# Altium schematic sheet Microcontroller.SchDoc
size A4; SheetNumber: 7; SheetTotal: 8
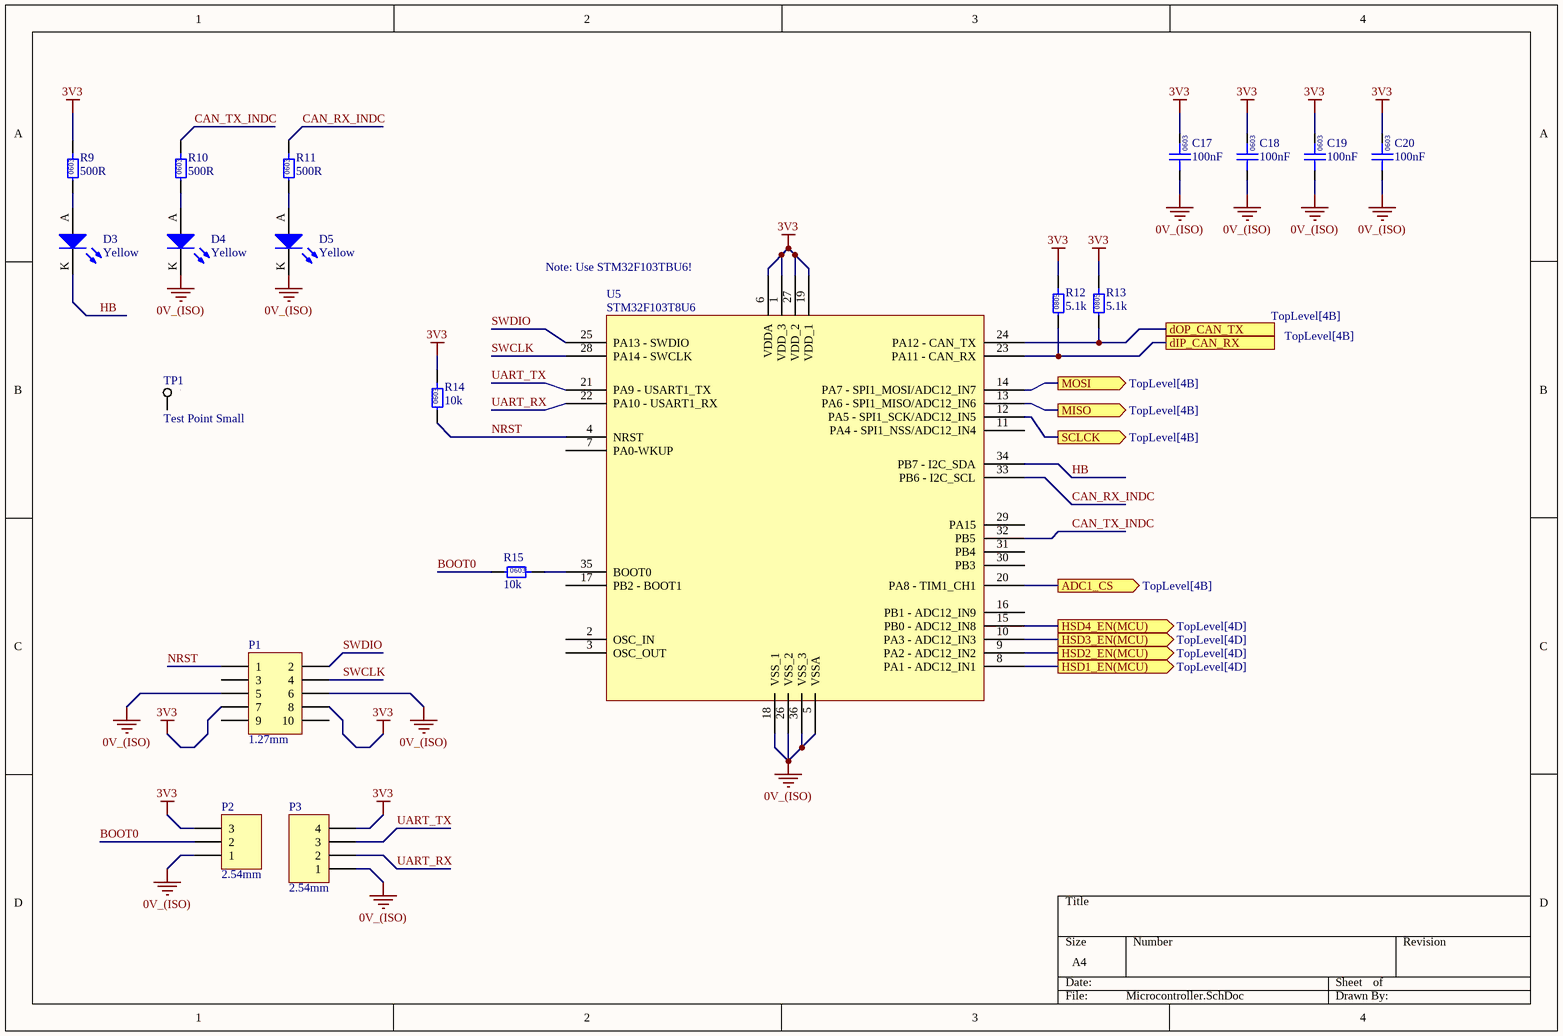
[diagram p0: Microcontroller.SchDoc]

## Parts
C17  100nF  [0603]
C18  100nF  [0603]
C19  100nF  [0603]
C20  100nF  [0603]
D3  Yellow  [0805 LED]
D4  Yellow  [0805 LED]
D5  Yellow  [0805 LED]
P1  1.27mm  [3221-10-0300-00]
P2  2.54mm  [TH 2.54mm Header 1x3]
P3  2.54mm  [TH 2.54mm Header 1x4]
R9  500R  [0603]
R10  500R  [0603]
R11  500R  [0603]
R12  5.1k  [0805]
R13  5.1k  [0805]
R14  10k  [0603]
R15  10k  [0603]
TP1  Test Point Small  [SMD Test Point 1mm]
U5  STM32F103T8U6  [STM_QFN-36]

## Ports
ADC1_CS (out, see TopLevel[4B]), dIP_CAN_RX (see TopLevel[4B]), dOP_CAN_TX (see TopLevel[4B]), HSD1_EN(MCU) (out, see TopLevel[4D]), HSD2_EN(MCU) (out, see TopLevel[4D]), HSD3_EN(MCU) (out, see TopLevel[4D]), HSD4_EN(MCU) (out, see TopLevel[4D]), MISO (out, see TopLevel[4B]), MOSI (out, see TopLevel[4B]), SCLCK (out, see TopLevel[4B])

## Nets
0V_(ISO): C17.1 C18.1 C19.1 C20.1 D4.K D5.K P1.5 P1.6 P2.1 P3.1 U5.5(VSSA) U5.18(VSS_1) U5.26(VSS_2) U5.36(VSS_3)
3V3: C17.2 C18.2 C19.2 C20.2 P1.7 P1.8 P2.3 P3.4 R9.2 R12.2 R13.2 R14.2 U5.1(VDD_3) U5.6(VDDA) U5.19(VDD_1) U5.27(VDD_2)
ADC1_CS: U5.20(PA8_-_TIM1_CH1) ; port ADC1_CS
BOOT0: P2.2 R15.1
CAN_RX_INDC: R11.2 U5.33(PB6_-_I2C_SCL)
CAN_TX_INDC: R10.2 U5.32(PB5)
dIP_CAN_RX: R12.1 U5.23(PA11_-_CAN_RX) ; port dIP_CAN_RX
dOP_CAN_TX: R13.1 U5.24(PA12_-_CAN_TX) ; port dOP_CAN_TX
HB: D3.K U5.34(PB7_-_I2C_SDA)
HSD1_EN(MCU): U5.8(PA1_-_ADC12_IN1) ; port HSD1_EN(MCU)
HSD2_EN(MCU): U5.9(PA2_-_ADC12_IN2) ; port HSD2_EN(MCU)
HSD3_EN(MCU): U5.10(PA3_-_ADC12_IN3) ; port HSD3_EN(MCU)
HSD4_EN(MCU): U5.15(PB0_-_ADC12_IN8) ; port HSD4_EN(MCU)
MISO: U5.13(PA6_-_SPI1_MISO/ADC12_IN6) ; port MISO
MOSI: U5.14(PA7_-_SPI1_MOSI/ADC12_IN7) ; port MOSI
NRST: P1.1 R14.1 U5.4(NRST)
SCLCK: U5.12(PA5_-_SPI1_SCK/ADC12_IN5) ; port SCLCK
SWCLK: P1.4 U5.28(PA14_-_SWCLK)
SWDIO: P1.2 U5.25(PA13_-_SWDIO)
UART_RX: P3.2 U5.22(PA10_-_USART1_RX)
UART_TX: P3.3 U5.21(PA9_-_USART1_TX)
NetD3_A: D3.A R9.1
NetD4_A: D4.A R10.1
NetD5_A: D5.A R11.1
NetR15_2: R15.2 U5.35(BOOT0)

Not connected (* = marked no-connect by the designer): P1 3 9 10; TP1 1; U5 2(OSC_IN) 3(OSC_OUT) 7(PA0-WKUP) 11(PA4_-_SPI1_NSS/ADC12_IN4) 16(PB1_-_ADC12_IN9) 17(PB2_-_BOOT1_) 29(PA15) 30(PB3) 31(PB4)

## Notes on the sheet
- (near U5) Note: Use STM32F103TBU6!
- (in symbol GCM188L81H104KA57D) 0603
- (in symbol RC0603FR-0710KL) 0603
- (in symbol RC0805FR075K1L) 0805
- (in symbol RT0603BRD07500RL) 0603

## Library data of the parts
C17-C20 = GCM188L81H104KA57D: Manufacturer: muRata; Rated Voltage: 50V; Tolerance: ±10%; Material: MLCC; Temperature Rating: X8L; Part Number: GCM188L81H104KA57D; Value: 100nF; Digikey Part Number: 490-6049-1-ND
D3-D5 = SML-211YTT86: Yellow LED Indication - Discrete 1.75V 0805 (2012 Metric); Manufacturer: ROHM Semiconductor; Part Number: SML-211YTT86; Colour: Yellow; Digikey Part Number: 511-1293-1-ND
P1 = SMD 1.27mm Header 2x5 (3221-10-0300-00): Positions: 10; Angle: 0; Flange: No; Contact: NA; Part Number: SMD 1.27mm Header 2x5 (3221-10-0300-00); Pitch: 1.27mm; Row Spacing: 1.27mm
P2 = TH 2.54mm Header 1x3: Positions: 3; Angle: 0; Flange: No; Contact: NA; Part Number: TH 2.54mm Header 1x3; Pitch: 2.54mm; Row Spacing: 2.54mm
P3 = TH 2.54mm Header 1x4: Positions: 4; Angle: 0; Flange: No; Contact: NA; Part Number: TH 2.54mm Header 1x4; Pitch: 2.54mm; Row Spacing: 2.54mm
R9-R11 = RT0603BRD07500RL: Manufacturer: YAGEO; Tolerance: 0.01; Rated Power: 0.1W; Part Number: RT0603BRD07500RL; Value: 500R; Material: FR-07; Digikey Part Number: 13-RT0603BRD07500RL-ND
R12 R13 = RC0805FR075K1L: Manufacturer: YAGEO; Tolerance: 0.01; Rated Power: 0.125W; Part Number: RC0805FR075K1L; Value: 5.1k; Material: FR-07; Digikey Part Number: 311-5.10KCRCT-ND
R14 R15 = RC0603FR-0710KL: Manufacturer: YAGEO; Tolerance: 0.01; Rated Power: 0.1W; Part Number: RC0603FR-0710KL; Value: 10k; Digikey Part Number: 311-10.0KHRCT-ND; Material: FR-07
TP1 = SMD Test Point Small: Positions: 1; Pitch: 0mm; Row Spacing: 0; Flange: No; Contact: NA; Part Number: SMD Test Point Small; Angle: 0
U5 = STM32F103T8U6: ARM® Cortex®-M3 STM32F1 Microcontroller IC 32-Bit 72MHz 64KB (64K x 8) FLASH QFN; Manufacturer: ST Microelectronics; Part Number: STM32F103T8U6; Digikey Part Number: STM32F103T8U6; Digikey Link: https://www.digikey.com/en/products/detail/stmicroelectronics/stm32f103t8u6/1852493